# Altium schematic sheet NullerDACs.SchDoc
size Letter
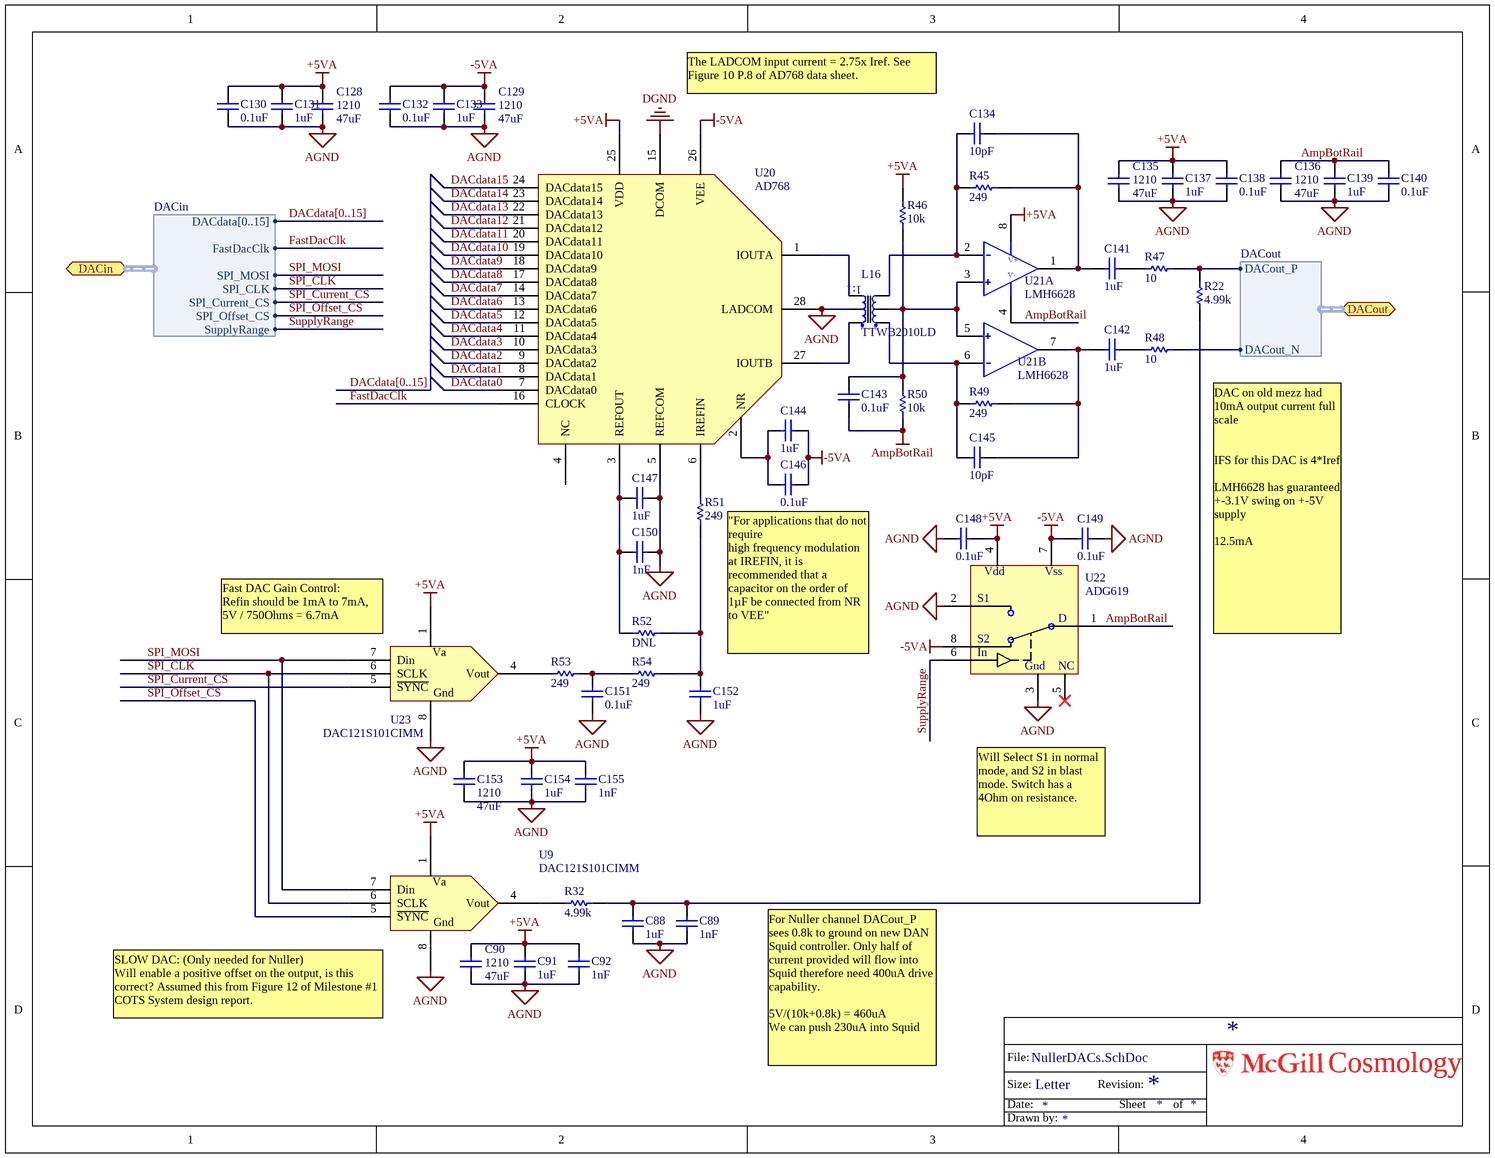
[diagram p0: NullerDACs.SchDoc]

## Parts
C88  1uF  [0603]
C89  1nF  [0603]
C90  Footprint: 1210  [CC3225-1210]  (hidden comment: 47uF)
C91  1uF  [0603]
C92  1nF  [0603]
C128  Footprint: 1210  [CC3225-1210]  (hidden comment: 47uF)
C129  Footprint: 1210  [CC3225-1210]  (hidden comment: 47uF)
C130  0.1uF  [0603]
C131  1uF  [0603]
C132  0.1uF  [0603]
C133  1uF  [0603]
C134  10pF  [0603]
C135  Footprint: 1210  [CC3225-1210]  (hidden comment: 47uF)
C136  Footprint: 1210  [CC3225-1210]  (hidden comment: 47uF)
C137  1uF  [0603]
C138  0.1uF  [0603]
C139  1uF  [0603]
C140  0.1uF  [0603]
C141  1uF  [0603]
C142  1uF  [0603]
C143  0.1uF  [0603]
C144  1uF  [0603]
C145  10pF  [0603]
C146  0.1uF  [0603]
C147  1uF  [0603]
C148  0.1uF  [0603]
C149  0.1uF  [0603]
C150  1nF  [0603]
C151  0.1uF  [0603]
C152  1uF  [0603]
C153  Footprint: 1210  [CC3225-1210]  (hidden comment: 47uF)
C154  1uF  [0603]
C155  1nF  [0603]
L16  TTWB2010LD  [TTWB]
R22  4.99k  [0603]
R32  4.99k  [0603]
R45  249  [0603]
R46  10k  [0603]
R47  10  [0603]
R48  10  [0603]
R49  249  [0603]
R50  10k  [0603]
R51  249  [0603]
R52  DNL  [0603]
R53  249  [0603]
R54  249  [0603]
U9  DAC121S101CIMM  [MSOP-8]
U20  AD768  [SOIC 28 300mils]
U21  LMH6628  [SO8]  (parts A,B of 2)
U22  ADG619  [SOT23-8]
U23  DAC121S101CIMM  [MSOP-8]

## Ports
DACin (harness DACin), DACout (harness DACout)

## Harnesses
DACin: DACdata[0..15], FastDacClk, SPI_MOSI, SPI_CLK, SPI_Current_CS, SPI_Offset_CS, SupplyRange
DACout: DACout_P, DACout_N

## Nets
+5VA: C90.2 C91.2 C92.2 C128.2 C130.2 C131.2 C135.2 C137.1 C138.1 C148.1 C153.1 C154.1 C155.1 R46.2 U9.1(Va) U20.25(VDD) U21.8(V+) U22.4(Vdd) U23.1(Va)
-5VA: C129.2 C132.2 C133.2 C144.1 C146.1 C149.2 U20.26(VEE) U22.7(Vss) U22.8(S2)
AGND: C88.1 C89.1 C90.1 C91.1 C92.1 C128.1 C129.1 C130.1 C131.1 C132.1 C133.1 C135.1 C136.1 C137.2 C138.2 C139.2 C140.2 C147.2 C148.2 C149.1 C150.2 C151.2 C152.2 C153.2 C154.2 C155.2 L16.2(PrimCent) U9.8(Gnd) U20.5(REFCOM) U20.28(LADCOM) U22.2(S1) U22.3(Gnd) U23.8(Gnd)
AmpBotRail: C136.2 C139.1 C140.1 C143.2 R50.1 U21.4(V-) U22.1(D)
DGND: U20.15(DCOM)
DACdata0: U20.7(DACdata0)
DACdata1: U20.8(DACdata1)
DACdata2: U20.9(DACdata2)
DACdata3: U20.10(DACdata3)
DACdata4: U20.11(DACdata4)
DACdata5: U20.12(DACdata5)
DACdata6: U20.13(DACdata6)
DACdata7: U20.14(DACdata7)
DACdata8: U20.17(DACdata8)
DACdata9: U20.18(DACdata9)
DACdata10: U20.19(DACdata10)
DACdata11: U20.20(DACdata11)
DACdata12: U20.21(DACdata12)
DACdata13: U20.22(DACdata13)
DACdata14: U20.23(DACdata14)
DACdata15: U20.24(DACdata15)
FastDacClk: U20.16(CLOCK) ; port DACin.FastDacClk
SPI_CLK: U9.6(SCLK) U23.6(SCLK) ; port DACin.SPI_CLK
SPI_Current_CS: U23.5(~{SYNC}) ; port DACin.SPI_Current_CS
SPI_MOSI: U9.7(Din) U23.7(Din) ; port DACin.SPI_MOSI
SPI_Offset_CS: U9.5(~{SYNC}) ; port DACin.SPI_Offset_CS
SupplyRange: U22.6(In) ; port DACin.SupplyRange
NetC88_2: C88.2 C89.2 R22.1 R32.1
NetC134_1: C134.1 L16.4(Sec) R45.1 U21.2(IN-)
NetC134_2: C134.2 C141.2 R45.2 U21.1(Out)
NetC141_1: C141.1 R47.1
NetC142_1: C142.1 R48.1
NetC142_2: C142.2 C145.2 R49.2 U21.7(Out)
NetC143_1: C143.1 L16.5(SecCent) R46.1 R50.2 U21.3(IN+) U21.5(IN+)
NetC144_2: C144.2 C146.2 U20.2(NR)
NetC145_1: C145.1 L16.6(SecDot) R49.1 U21.6(IN-)
NetC147_1: C147.1 C150.1 R52.1 U20.3(REFOUT)
NetC151_1: C151.1 R53.1 R54.2
NetC152_1: C152.1 R51.2 R52.2 R54.1
NetL16_1: L16.1(PrimDot) U20.27(IOUTB)
NetL16_3: L16.3(Prim) U20.1(IOUTA)
NetR22_2: R22.2 R47.2 ; port DACout.DACout_P
NetR32_2: R32.2 U9.4(Vout)
NetR48_2: R48.2 ; port DACout.DACout_N
NetR51_1: R51.1 U20.6(IREFIN)
NetR53_2: R53.2 U23.4(Vout)

Not connected (* = marked no-connect by the designer): U9 2(NC) 3(NC); U20 4(NC); U22 5(NC)*; U23 2(NC) 3(NC)

## Buses and harness runs
bus DACdata[0..15]

## Notes on the sheet
- The LADCOM input current = 2.75x Iref. See Figure 10 P.8 of AD768 data sheet.
- (near U23) Fast DAC Gain Control:
  Refin should be 1mA to 7mA, 5V / 750Ohms = 6.7mA
- DAC on old mezz had 10mA output current full scale
  IFS for this DAC is 4*Iref
  LMH6628 has guaranteed  +-3.1V swing on +-5V supply
  12.5mA
- "For applications that do not require
  high frequency modulation at IREFIN, it is recommended that a capacitor on the order of 1µF be connected from NR to VEE"
- Will Select S1 in normal mode, and S2 in blast mode. Switch has a 4Ohm on resistance.
- (near U9) SLOW DAC: (Only needed for Nuller)
  Will enable a positive offset on the output, is this correct? Assumed this from Figure 12 of Milestone #1 COTS System design report.
- For Nuller channel DACout_P sees 0.8k to ground on new DAN Squid controller. Only half of current provided will flow into Squid therefore need 400uA drive capability.
  5V/(10k+0.8k) = 460uA
  We can push 230uA into Squid
- File:
- Size:
- Date:
- Letter
- Revision:
- Sheet
- of
- Cosmology
- Drawn by:
- (in symbol TTWB2010LD) 1:1

## Library data of the parts
C88 C89 C91 C92 C130-C134 C137-C152 C154 C155 = CAP 0603: Capacitor, Ceramic, 0603; Part Constraints: 10% 16V X7R 0603; Manufacturer: Generic; Manufacturers Part Number: Generic; Type: Capacitor; SupplierUnitCost: 0
  C88 C91 C131 C133 C137 C139 C141 C142 C144 C147 C152 C154: Value: 1uF
  C89 C92 C150 C155: Value: 1nF
  C130 C132 C138 C140 C143 C146 C148 C149 C151: Value: 0.1uF
  C134 C145: Value: 10pF
C90 C128 C129 C135 C136 C153 = CAP 1210: Capacitor, Ceramic, 1210; Manufacturer: Taiyo Yuden; Part Constraints: 1210 10V X7R; Manufacturers Part Number: LMK325B7476MM; Value: 47uF; Type: Capacitor; SupplierUnitCost: $0.54
L16 = TTWB2010LD: Transformer; Manufacturer: Coil Craft; Assembly Comments: none; Manufacturers Part Number: TTWB2010LD; Part Constraints: TTWB2010LD; Supplier 1: Coil Craft; Supplier Part Number 1: TTWB2010LD; SupplierUnitCost: $3.25
R22 R32 R45-R54 = RES 0603: Resistor; Manufacturer: Generic; Part Constraints: 1% 1/10W 100ppm 0603; Manufacturers Part Number: Generic; Type: Resistor; SupplierUnitCost: 0
  R22 R32: Value: 4.99k
  R45 R49 R51 R53 R54: Value: 249
  R46 R50: Value: 10k
  R47 R48: Value: 10
  R52: Value: DNL
U9 U23 = DAC121S101CIMM/NOPB: CONV D/A 12BIT MICROPWR 8MSOP; Manufacturer: National Semiconductor; Settling Time: 12µs; Number of Bits: 12; Data Interface: DSP, MICROWIRE™, QSPI™, Serial, SPI™; Number of Converters: 1; Voltage Supply Source: Single Supply; Power Dissipation (Max): 1.72mW; Number of Outputs and Type: 1 Voltage, Unipolar; 1 Voltage, Bipolar; RoHS: RoHS Compliant; Category: Integrated Circuits (ICs); Stock 1: 3011; Pricing 1: 1=3.5, 25=2.8616, 100=2.5698, 250=2.33624, 500=2.0442 (CAD); Operating Temperature: -40°C ~ 105°C; Mounting Type: Surface Mount; Package / Case: 8-TSSOP, 8-MSOP (0.118", 3.00mm Width); Supplier Device Package: 8-MSOP; Packaging: Cut Tape (CT); Sampling Rate (Per Second): *; ComponentLink1URL: http://www.ti.com/lit/ds/symlink/dac121s101.pdf; ComponentLink1Description: http://www.ti.com/lit/ds/symlink/dac121s101.pdf; Supplier 1: Digi-Key; Supplier Part Number 1: DAC121S101CIMMCT-ND; Part Constraints: DAC121S101CIMM/NOPB; Manufacturers Part Number: DAC121S101CIMM/NOPB; Type: IC; SupplierUnitCost: $3.70
U20 = AD768: DAC 16bit 30MSPS; Manufacturers Part Number: AD768ARZ; Manufacturer: Analog Devices; Assembly Comments: none; Part Constraints: AD768ARZ; Supplier 1: Digi-Key; Supplier Part Number 1: AD768ARZ-ND; Type: IC; SupplierUnitCost: $46.27
U21 = LMH6628: Dual Opamp 200Mhz GBP Soic 8; Part Constraints: LMH6628MA/NOPB; Manufacturer: National Semiconductor; Assembly Comments: none; Manufacturers Part Number: LMH6628MA/NOPB; Type: IC; SupplierUnitCost: $4.44; Supplier 1: Digi-Key; Supplier Part Number 1: LMH6628MA-ND
U22 = ADG619: SPDT Switch +-5V 4 Ohm on resistance; Manufacturer: Analog Devices; Manufacturers Part Number: ADG619BRTZ; Assembly Comments: none; Part Constraints: ADG619BRTZ; Type: IC; SupplierUnitCost: $3.05